# EAGLE design TMR03 (EAGLE 9.2.0)
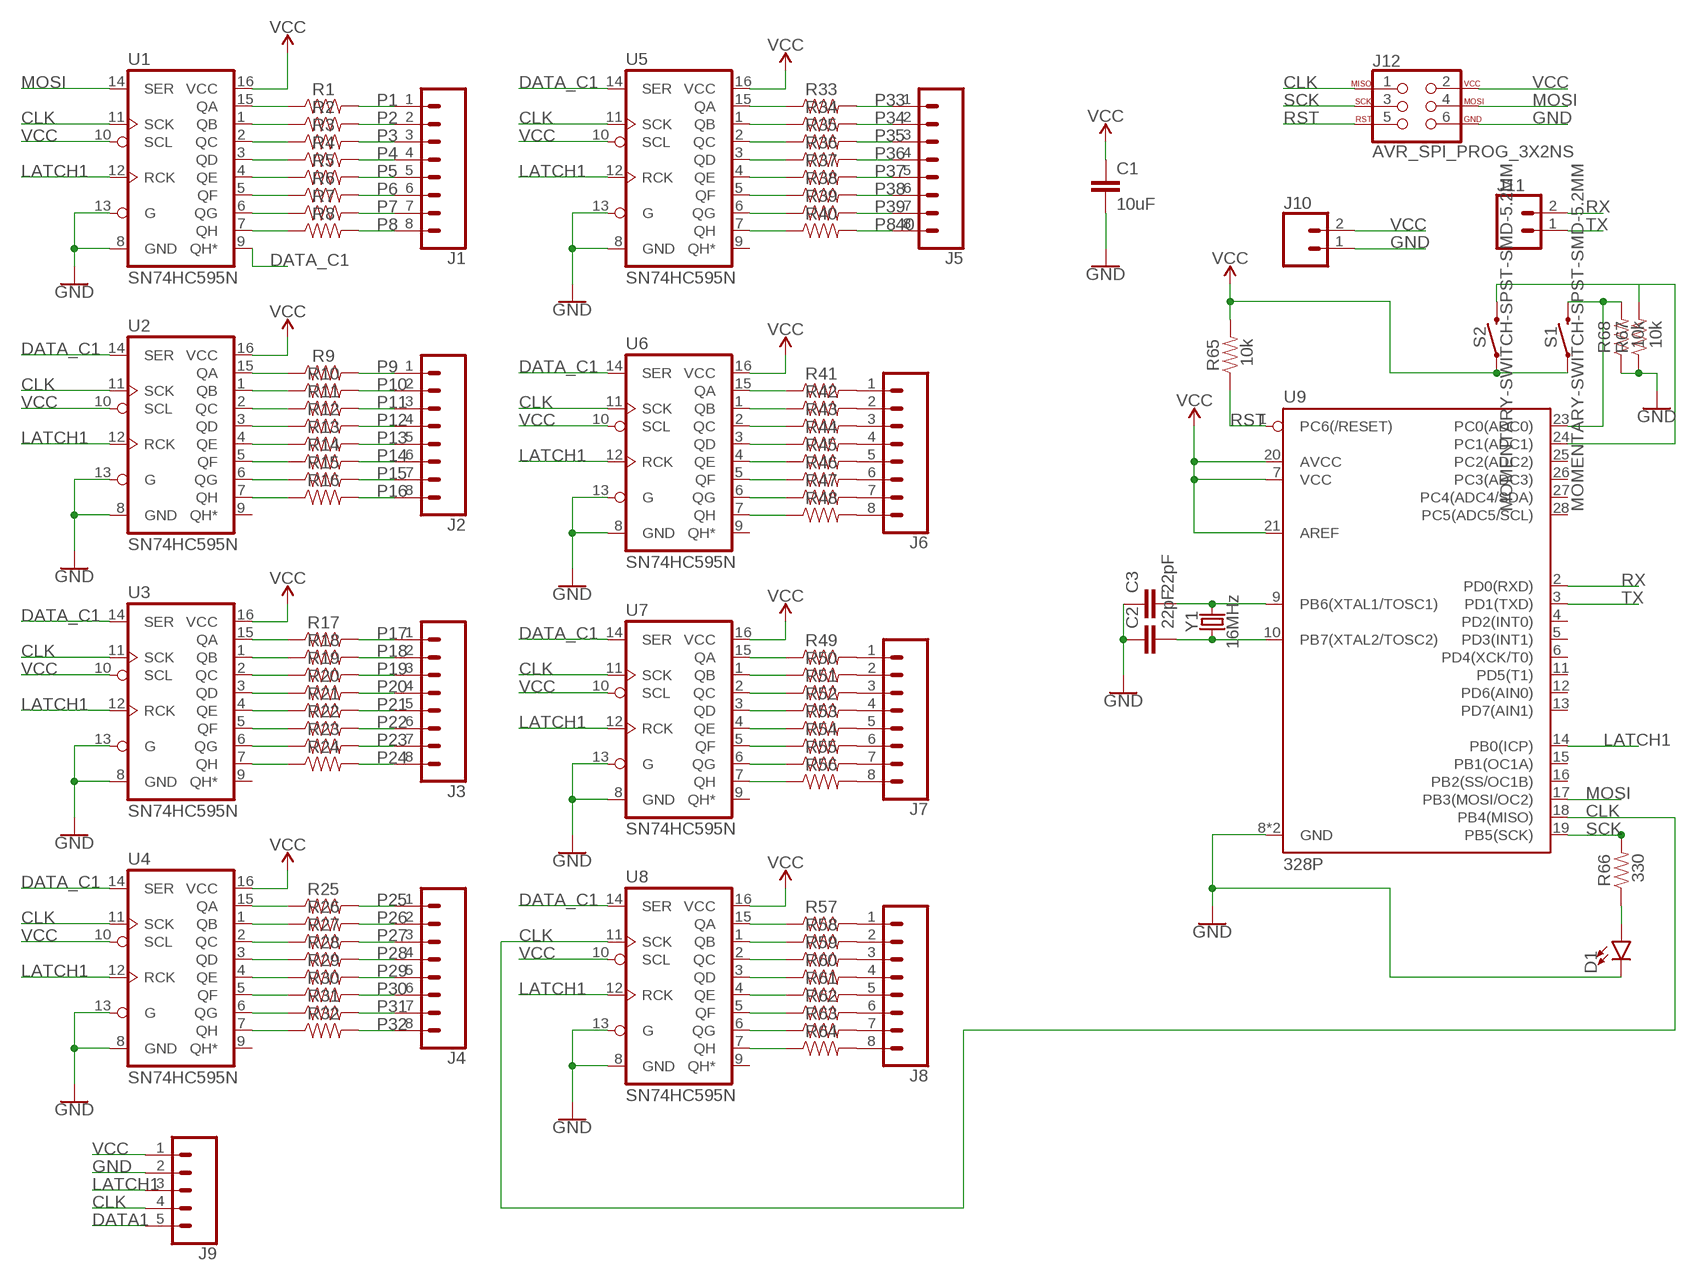
[diagram p0: schematic, sheet 1]

## Parts
C1  10uF  10UF-1206-6.3V-20%  [1206]
C2  22pF  10UF-1206-6.3V-20%  [1206]
C3  22pF  10UF-1206-6.3V-20%  [1206]
D1  LED3MM  [LED_3MM]
J1  CONN_08"  [1X08]
J2  CONN_08"  [1X08]
J3  CONN_08"  [1X08]
J4  CONN_08"  [1X08]
J5  CONN_08"  [1X08]
J6  CONN_08"  [1X08]
J7  CONN_08"  [1X08]
J8  CONN_08"  [1X08]
J9  CONN_05  [1X05]
J10  CONN_02JST-PTH-2  [JST-2-PTH]
J11  CONN_02  [1X02]
J12  AVR_SPI_PROG_3X2NS  [2X3-NS]
R1  RESISTOR1206  [1206]
R2  RESISTOR1206  [1206]
R3  RESISTOR1206  [1206]
R4  RESISTOR1206  [1206]
R5  RESISTOR1206  [1206]
R6  RESISTOR1206  [1206]
R7  RESISTOR1206  [1206]
R8  RESISTOR1206  [1206]
R9  RESISTOR1206  [1206]
R10  RESISTOR1206  [1206]
R11  RESISTOR1206  [1206]
R12  RESISTOR1206  [1206]
R13  RESISTOR1206  [1206]
R14  RESISTOR1206  [1206]
R15  RESISTOR1206  [1206]
R16  RESISTOR1206  [1206]
R17  RESISTOR1206  [1206]
R18  RESISTOR1206  [1206]
R19  RESISTOR1206  [1206]
R20  RESISTOR1206  [1206]
R21  RESISTOR1206  [1206]
R22  RESISTOR1206  [1206]
R23  RESISTOR1206  [1206]
R24  RESISTOR1206  [1206]
R25  RESISTOR1206  [1206]
R26  RESISTOR1206  [1206]
R27  RESISTOR1206  [1206]
R28  RESISTOR1206  [1206]
R29  RESISTOR1206  [1206]
R30  RESISTOR1206  [1206]
R31  RESISTOR1206  [1206]
R32  RESISTOR1206  [1206]
R33  RESISTOR1206  [1206]
R34  RESISTOR1206  [1206]
R35  RESISTOR1206  [1206]
R36  RESISTOR1206  [1206]
R37  RESISTOR1206  [1206]
R38  RESISTOR1206  [1206]
R39  RESISTOR1206  [1206]
R40  RESISTOR1206  [1206]
R41  RESISTOR1206  [1206]
R42  RESISTOR1206  [1206]
R43  RESISTOR1206  [1206]
R44  RESISTOR1206  [1206]
R45  RESISTOR1206  [1206]
R46  RESISTOR1206  [1206]
R47  RESISTOR1206  [1206]
R48  RESISTOR1206  [1206]
R49  RESISTOR1206  [1206]
R50  RESISTOR1206  [1206]
R51  RESISTOR1206  [1206]
R52  RESISTOR1206  [1206]
R53  RESISTOR1206  [1206]
R54  RESISTOR1206  [1206]
R55  RESISTOR1206  [1206]
R56  RESISTOR1206  [1206]
R57  RESISTOR1206  [1206]
R58  RESISTOR1206  [1206]
R59  RESISTOR1206  [1206]
R60  RESISTOR1206  [1206]
R61  RESISTOR1206  [1206]
R62  RESISTOR1206  [1206]
R63  RESISTOR1206  [1206]
R64  RESISTOR1206  [1206]
R65  10k  RESISTOR1206  [1206]
R66  330  RESISTOR1206  [1206]
R67  10k  RESISTOR1206  [1206]
R68  10k  RESISTOR1206  [1206]
S1  MOMENTARY-SWITCH-SPST-SMD-5.2MM  [TACTILE_SWITCH_SMD_5.2MM]
S2  MOMENTARY-SWITCH-SPST-SMD-5.2MM  [TACTILE_SWITCH_SMD_5.2MM]
U1  SN74HC595N  74HC595N  [DIP16]
U2  SN74HC595N  74HC595N  [DIP16]
U3  SN74HC595N  74HC595N  [DIP16]
U4  SN74HC595N  74HC595N  [DIP16]
U5  SN74HC595N  74HC595N  [DIP16]
U6  SN74HC595N  74HC595N  [DIP16]
U7  SN74HC595N  74HC595N  [DIP16]
U8  SN74HC595N  74HC595N  [DIP16]
U9  328P  ATMEGA328P_PDIP  [DIP28]
Y1  16MHz  CRYSTAL-16MHZPTH-HC49US  [HC49US]

## Nets
CLK: J9.4 J12.1 U1.11(SCK) U2.11(SCK) U3.11(SCK) U4.11(SCK) U5.11(SCK) U6.11(SCK) U7.11(SCK) U8.11(SCK) U9.18(PB4(MISO))
DATA1: J9.5
DATA_C1: U1.9(QH*) U2.14(SER) U3.14(SER) U4.14(SER) U5.14(SER) U6.14(SER) U7.14(SER) U8.14(SER)
GND: C1.2 C2.1 C3.1 J9.2 J10.1 J12.6 R67.1 R68.1 U1.8(GND) U1.13(G) U2.8(GND) U2.13(G) U3.8(GND) U3.13(G) U4.8(GND) U4.13(G) U5.8(GND) U5.13(G) U6.8(GND) U6.13(G) U7.8(GND) U7.13(G) U8.8(GND) U8.13(G)
LATCH1: J9.3 U1.12(RCK) U2.12(RCK) U3.12(RCK) U4.12(RCK) U5.12(RCK) U6.12(RCK) U7.12(RCK) U8.12(RCK) U9.14(PB0(ICP))
MOSI: J12.4 U1.14(SER) U9.17(PB3(MOSI/OC2))
N$1: R1.1 U1.15(QA)
N$2: R2.1 U1.1(QB)
N$3: R3.1 U1.2(QC)
N$4: R4.1 U1.3(QD)
N$5: R5.1 U1.4(QE)
N$6: R6.1 U1.5(QF)
N$7: R7.1 U1.6(QG)
N$8: R8.1 U1.7(QH)
N$9: R9.1 U2.15(QA)
N$10: R10.1 U2.1(QB)
N$11: R11.1 U2.2(QC)
N$12: R12.1 U2.3(QD)
N$13: R13.1 U2.4(QE)
N$14: R14.1 U2.5(QF)
N$15: R15.1 U2.6(QG)
N$16: R16.1 U2.7(QH)
N$17: R17.1 U3.15(QA)
N$18: R18.1 U3.1(QB)
N$19: R19.1 U3.2(QC)
N$20: R20.1 U3.3(QD)
N$21: R21.1 U3.4(QE)
N$22: R22.1 U3.5(QF)
N$23: R23.1 U3.6(QG)
N$24: R24.1 U3.7(QH)
N$25: R25.1 U4.15(QA)
N$26: R26.1 U4.1(QB)
N$27: R27.1 U4.2(QC)
N$28: R28.1 U4.3(QD)
N$29: R29.1 U4.4(QE)
N$30: R30.1 U4.5(QF)
N$31: R31.1 U4.6(QG)
N$32: R32.1 U4.7(QH)
N$33: R33.1 U5.15(QA)
N$34: R34.1 U5.1(QB)
N$35: R35.1 U5.2(QC)
N$36: R36.1 U5.3(QD)
N$37: R37.1 U5.4(QE)
N$38: R38.1 U5.5(QF)
N$39: R39.1 U5.6(QG)
N$40: R40.1 U5.7(QH)
N$41: R41.1 U6.15(QA)
N$42: R42.1 U6.1(QB)
N$43: R43.1 U6.2(QC)
N$44: R44.1 U6.3(QD)
N$45: R45.1 U6.4(QE)
N$46: R46.1 U6.5(QF)
N$47: R47.1 U6.6(QG)
N$48: R48.1 U6.7(QH)
N$49: R49.1 U7.15(QA)
N$50: R50.1 U7.1(QB)
N$51: R51.1 U7.2(QC)
N$52: R52.1 U7.3(QD)
N$53: R53.1 U7.4(QE)
N$54: R54.1 U7.5(QF)
N$55: R55.1 U7.6(QG)
N$56: R56.1 U7.7(QH)
N$57: R57.1 U8.15(QA)
N$58: R58.1 U8.1(QB)
N$59: R59.1 U8.2(QC)
N$60: R60.1 U8.3(QD)
N$61: R61.1 U8.4(QE)
N$62: R62.1 U8.5(QF)
N$63: R63.1 U8.6(QG)
N$64: R64.1 U8.7(QH)
N$65: J6.1 R41.2
N$66: J6.2 R42.2
N$67: J6.3 R43.2
N$68: J6.4 R44.2
N$69: J6.5 R45.2
N$70: J6.6 R46.2
N$71: J6.7 R47.2
N$72: J6.8 R48.2
N$73: J7.1 R49.2
N$74: J7.2 R50.2
N$75: J7.3 R51.2
N$76: J7.4 R52.2
N$77: J7.5 R53.2
N$78: J7.6 R54.2
N$79: J7.7 R55.2
N$80: J7.8 R56.2
N$81: J8.1 R57.2
N$82: J8.2 R58.2
N$83: J8.3 R59.2
N$84: J8.4 R60.2
N$85: J8.5 R61.2
N$86: J8.6 R62.2
N$87: J8.7 R63.2
N$88: J8.8 R64.2
N$89: C3.2 U9.9(PB6(XTAL1/TOSC1)) Y1.2
N$90: R68.2 S1.3 U9.23(PC0(ADC0))
N$91: C2.2 U9.10(PB7(XTAL2/TOSC2)) Y1.1
N$92: R65.2 S1.1 S2.1 ; supply symbol labelled VCC
N$93: U9.7(VCC) U9.20(AVCC) U9.21(AREF) ; supply symbol labelled VCC
N$94: D1.K(C) U9.8(GND) U9.22(GND) ; supply symbol labelled GND
N$95: R67.2 S2.3 U9.24(PC1(ADC1))
N$96: D1.A R66.1
P1: J1.1 R1.2
P2: J1.2 R2.2
P3: J1.3 R3.2
P4: J1.4 R4.2
P5: J1.5 R5.2
P6: J1.6 R6.2
P7: J1.7 R7.2
P8: J1.8 R8.2
P9: J2.1 R9.2
P10: J2.2 R10.2
P11: J2.3 R11.2
P12: J2.4 R12.2
P13: J2.5 R13.2
P14: J2.6 R14.2
P15: J2.7 R15.2
P16: J2.8 R16.2
P17: J3.1 R17.2
P18: J3.2 R18.2
P19: J3.3 R19.2
P20: J3.4 R20.2
P21: J3.5 R21.2
P22: J3.6 R22.2
P23: J3.7 R23.2
P24: J3.8 R24.2
P25: J4.1 R25.2
P26: J4.2 R26.2
P27: J4.3 R27.2
P28: J4.4 R28.2
P29: J4.5 R29.2
P30: J4.6 R30.2
P31: J4.7 R31.2
P32: J4.8 R32.2
P33: J5.1 R33.2
P34: J5.2 R34.2
P35: J5.3 R35.2
P36: J5.4 R36.2
P37: J5.5 R37.2
P38: J5.6 R38.2
P39: J5.7 R39.2
P840: J5.8 R40.2
RST: J12.5 R65.1 U9.1(PC6(/RESET))
RX: J11.2 U9.2(PD0(RXD))
SCK: J12.3 R66.2 U9.19(PB5(SCK))
TX: J11.1 U9.3(PD1(TXD))
VCC: C1.1 J9.1 J10.2 J12.2 U1.10(SCL) U1.16(VCC) U2.10(SCL) U2.16(VCC) U3.10(SCL) U3.16(VCC) U4.10(SCL) U4.16(VCC) U5.10(SCL) U5.16(VCC) U6.10(SCL) U6.16(VCC) U7.10(SCL) U7.16(VCC) U8.10(SCL) U8.16(VCC)
Unconnected: U2.9(QH*) U3.9(QH*) U4.9(QH*) U5.9(QH*) U6.9(QH*) U7.9(QH*) U8.9(QH*) U9.4(PD2(INT0)) U9.5(PD3(INT1)) U9.6(PD4(XCK/T0)) U9.11(PD5(T1)) U9.12(PD6(AIN0)) U9.13(PD7(AIN1)) U9.15(PB1(OC1A)) U9.16(PB2(SS/OC1B)) U9.25(PC2(ADC2)) U9.26(PC3(ADC3)) U9.27(PC4(ADC4/SDA)) U9.28(PC5(ADC5/SCL))

## Library data of the parts
C1 = SparkFun-Capacitors:10UF: 10.0µF ceramic capacitors A capacitor is a passive two-terminal electrical component used to store electrical energy temporarily in an electric field.; PROD_ID: CAP-10057
C2 C3 = SparkFun-Capacitors:10UF: 10.0µF ceramic capacitors A capacitor is a passive two-terminal electrical component used to store electrical energy temporarily in an electric field.; PROD_ID: CAP-10057; VALUE: 10uF
D1 = SparkFun-LED:LED: LED (Generic) Standard schematic elements and footprints for 5mm, 3mm, 1206, and 0603 sized LEDs. Generic LEDs with no color specified.; PROD_ID: DIO-08794
J1-J8 = SparkFun-Connectors:CONN_08: Multi connection point. Often used as Generic Header-pin footprint for 0.1 inch spaced/style header connections On any of the 0.1 inch spaced packages, you can populate with these: Break Away Headers - Straight <https://www.sparkfun.com/products/116> (PRT-00116) Break Away Male Headers - Right Angle <https://www.sparkfun.com/products/553> (PRT-00553) Female Headers <https://www.sparkfun.com/products/115> (PRT-00115) Break Away Headers - Machine Pin <https://www.sparkfun.com/products/117> (PRT-00117) Break Away Female Headers - Swiss Machine Pin <https://www.sparkfun.com/products/743> (PRT-00743) Arduino Stackable Header - 8 Pin <https://www.sparkfun.com/products/9279> (PRT-09279) For SCREWTERMINALS and SPRING TERMINALS visit here: Screw Terimnals on SparkFun.com <https://www.sparkfun.com/search/results?term=Screw+Terminals> (5mm/3.5mm/2.54mm spacing) This device is also useful as a general connection point to wire up your design to another part of your project. Our various solder wires solder well into these plated through hole pads. Hook-Up Wire - Assortment (Stranded, 22 AWG) <https://www.sparkfun.com/products/11375> (PRT-11375) Hook-Up Wire - Assortment (Solid Core, 22 AWG) <https://www.sparkfun.com/products/11367> (PRT-11367) View the entire wire category on our website here <https://www.sparkfun.com/categories/141> Special notes: Molex polarized connector foot print use with SKU : PRT-08231 with associated crimp pins and housings. 1MM SMD Version SKU: PRT-10208 NOTES ON THE VARIANTS LOCK and LOCK_LONGPADS... This footprint was designed to help hold the alignment of a through-hole component (i.e. 6-pin header) while soldering it into place. You may notice that each hole has been shifted either up or down by 0.005 of an inch from it's more standard position (which is a perfectly straight line). This slight alteration caused the pins (the squares in the middle) to touch the edges of the holes. Because they are alternating, it causes a "brace" to hold the component in place. 0.005 has proven to be the perfect amount of "off-center" position when using our standard breakaway headers. Although looks a little odd when you look at the bare footprint, once you have a header in there, the alteration is very hard to notice. Also,if you push a header all the way into place, it is covered up entirely on the bottom side.; PROD_ID: CONN-08438
J9 = SparkFun-Connectors:CONN_05: Multi connection point. Often used as Generic Header-pin footprint for 0.1 inch spaced/style header connections On any of the 0.1 inch spaced packages, you can populate with these: Break Away Headers - Straight <https://www.sparkfun.com/products/116> (PRT-00116) Break Away Male Headers - Right Angle <https://www.sparkfun.com/products/553> (PRT-00553) Female Headers <https://www.sparkfun.com/products/115> (PRT-00115) Break Away Headers - Machine Pin <https://www.sparkfun.com/products/117> (PRT-00117) Break Away Female Headers - Swiss Machine Pin <https://www.sparkfun.com/products/743> (PRT-00743) For SCREWTERMINALS and SPRING TERMINALS visit here: Screw Terimnals on SparkFun.com <https://www.sparkfun.com/search/results?term=Screw+Terminals> (5mm/3.5mm/2.54mm spacing) This device is also useful as a general connection point to wire up your design to another part of your project. Our various solder wires solder well into these plated through hole pads. Hook-Up Wire - Assortment (Stranded, 22 AWG) <https://www.sparkfun.com/products/11375> (PRT-11375) Hook-Up Wire - Assortment (Solid Core, 22 AWG) <https://www.sparkfun.com/products/11367> (PRT-11367) View the entire wire category on our website here <https://www.sparkfun.com/categories/141> Special notes: Molex polarized connector foot print use with SKU : PRT-08231 with associated crimp pins and housings. 1MM SMD Version SKU: PRT-10208
J10 = SparkFun-Connectors:CONN_02: Multi connection point. Often used as Generic Header-pin footprint for 0.1 inch spaced/style header connections On any of the 0.1 inch spaced packages, you can populate with these: Break Away Headers - Straight <https://www.sparkfun.com/products/116> (PRT-00116) Break Away Male Headers - Right Angle <https://www.sparkfun.com/products/553> (PRT-00553) Female Headers <https://www.sparkfun.com/products/115> (PRT-00115) Break Away Headers - Machine Pin <https://www.sparkfun.com/products/117> (PRT-00117) Break Away Female Headers - Swiss Machine Pin <https://www.sparkfun.com/products/743> (PRT-00743) For SCREWTERMINALS and SPRING TERMINALS visit here: Screw Terimnals on SparkFun.com <https://www.sparkfun.com/search/results?term=Screw+Terminals> (5mm/3.5mm/2.54mm spacing) This device is also useful as a general connection point to wire up your design to another part of your project. Our various solder wires solder well into these plated through hole pads. Hook-Up Wire - Assortment (Stranded, 22 AWG) <https://www.sparkfun.com/products/11375> (PRT-11375) Hook-Up Wire - Assortment (Solid Core, 22 AWG) <https://www.sparkfun.com/products/11367> (PRT-11367) View the entire wire category on our website here <https://www.sparkfun.com/categories/141> Special notes: Molex polarized connector foot print use with: PRT-08233 with associated crimp pins and housings. 2.54_SCREWTERM for use with PRT-10571. 3.5mm Screw Terminal footprints for PRT-08084 5mm Screw Terminal footprints for use with PRT-08432; PROD_ID: CONN-09863; SKU: PRT-09914
J11 = SparkFun-Connectors:CONN_02: Multi connection point. Often used as Generic Header-pin footprint for 0.1 inch spaced/style header connections On any of the 0.1 inch spaced packages, you can populate with these: Break Away Headers - Straight <https://www.sparkfun.com/products/116> (PRT-00116) Break Away Male Headers - Right Angle <https://www.sparkfun.com/products/553> (PRT-00553) Female Headers <https://www.sparkfun.com/products/115> (PRT-00115) Break Away Headers - Machine Pin <https://www.sparkfun.com/products/117> (PRT-00117) Break Away Female Headers - Swiss Machine Pin <https://www.sparkfun.com/products/743> (PRT-00743) For SCREWTERMINALS and SPRING TERMINALS visit here: Screw Terimnals on SparkFun.com <https://www.sparkfun.com/search/results?term=Screw+Terminals> (5mm/3.5mm/2.54mm spacing) This device is also useful as a general connection point to wire up your design to another part of your project. Our various solder wires solder well into these plated through hole pads. Hook-Up Wire - Assortment (Stranded, 22 AWG) <https://www.sparkfun.com/products/11375> (PRT-11375) Hook-Up Wire - Assortment (Solid Core, 22 AWG) <https://www.sparkfun.com/products/11367> (PRT-11367) View the entire wire category on our website here <https://www.sparkfun.com/categories/141> Special notes: Molex polarized connector foot print use with: PRT-08233 with associated crimp pins and housings. 2.54_SCREWTERM for use with PRT-10571. 3.5mm Screw Terminal footprints for PRT-08084 5mm Screw Terminal footprints for use with PRT-08432
J12 = SparkFun-Connectors:AVR_SPI_PROG_3X2: AVR ISP 6 Pin This is the reduced ISP connector for AVR programming. Common on Arduino. This footprint will take up less PCB space and can be used with a 10-pin to 6-pin adapter such as SKU: BOB-08508 **Special note about "TEST_POINT" package. The stop mask is on the top side, so if you want your programming test points to be on the bottom of your board, make sure to place this package on the bottom side of the board. This also ensure that the orientation to program from the bottom side will be correct. SparkFun Products: SparkFun ISP Pogo Adapter <https://www.sparkfun.com/products/11591> - NS Tiny AVR Programmer <https://www.sparkfun.com/products/11801> -PTH
R1-R68 = SparkFun-Resistors:RESISTOR: Generic Resistor Package
S1 S2 = SparkFun-Switches:MOMENTARY-SWITCH-SPST: Momentary Switch (Pushbutton) - SPST Normally-open (NO) SPST momentary switches (buttons, pushbuttons). Variants PTH-12MM - 12mm square, through-hole Momentary Pushbutton Switch - 12mm Square <https://www.sparkfun.com/products/9190> (COM-09190) PTH-6.0MM, PTH-6.0MM-KIT - 6.0mm square, through-hole Mini Pushbutton Switch <https://www.sparkfun.com/products/97> (COM-00097) KIT package intended for soldering kit's - only one side of pads' copper is exposed. PTH-RIGHT-ANGLE-KIT - Right-angle, through-hole Right Angle Tactile Button <https://www.sparkfun.com/products/10791> - Used on SparkFun BigTime Watch Kit <https://www.sparkfun.com/products/11734> SMD-12MM - 12mm square, surface-mount Tactile Button - SMD (12mm) <https://www.sparkfun.com/products/12993> (COM-12993) Used on SparkFun PicoBoard <https://www.sparkfun.com/products/11888> SMD-4.5MM - 4.5mm Square Trackball Switch Used on SparkFun Blackberry Trackballer Breakout <https://www.sparkfun.com/products/13169> SMD-4.6MMX2.8MM - 4.60mm x 2.80mm, surface mount Used on SparkFun SAMD21 Mini Breakout <https://www.sparkfun.com/products/13664> SMD-5.2MM, SMD-5.2-REDUNDANT - 5.2mm square, surface-mount Mini Pushbutton Switch - SMD <https://www.sparkfun.com/products/8720> (COM-08720) Used on Arduino Pro Mini <https://www.sparkfun.com/products/11114> REDUNDANT package connects both switch circuits together SMD-6.0X3.5MM - 6.0 x 3.5mm, surface mount Momentary Reset Switch SMD <https://www.sparkfun.com/products/8229> (COM-08229) SMD-6.2MM-TALL - 6.2mm square, surface mount Tactile Button - SMD (6mm) <https://www.sparkfun.com/products/12992> Used on SparkFun Digital Sandbox <https://www.sparkfun.com/products/12651> SMD-RIGHT-ANGLE - Right-angle, surface mount Used on SparkFun Block for Intel® Edison - Arduino <https://www.sparkfun.com/products/13036>; PROD_ID: SWCH-08247; SF_SKU: COM-08720
U1-U8 = SparkFun-IC-Logic:74*595: 8-Bit Shift Register (Serial to Parallel) Datasheet <http://cdn.sparkfun.com/datasheets/BreakoutBoards/MM74HC595.pdf> SparkFun Products SparkFun Shift Register Breakout - 74HC595 <https://www.sparkfun.com/products/10680> (BOB-10680); PROD_ID: IC-13123
U9 = SparkFun-IC-Microcontroller:ATMEGA328P_PDIP: Atmel 328P Through hole ATMEGA328P uC used in the Arduino 32kb flash, 1k EEPROM, 2k SRAM Datasheet <http://www.sparkfun.com/datasheets/Components/SMD/ATMega328.pdf> SparkFun Products Storefront component: AVR 28 Pin 20MHz 32K 6A/D - ATMega328P <https://www.sparkfun.com/products/9061> (COM-09061) SparkFun Simon Says - Through-Hole Soldering Kit <https://www.sparkfun.com/products/10547> (KIT-10547) SparkFun Learn to Solder - Simon Says <https://www.sparkfun.com/products/13708> (KIT-13708) SparkFun BigTime Watch Kit <https://www.sparkfun.com/products/11734> (KIT-11734) SparkFun ClockIt <https://www.sparkfun.com/products/10930> (KIT-10930) SparkFun Serial Enabled LCD Kit <https://www.sparkfun.com/products/10097> (LCD-10097) SparkFun Simon Tilts - Through Hole Soldering Kit <https://www.sparkfun.com/products/12634> (KIT-12634) SparkFun Frequency Counter Kit <https://www.sparkfun.com/products/10140> (KIT-10140) FabFM Radio Kit <https://www.sparkfun.com/products/11043> (KIT-11043) SparkFun Binary Blaster Kit <https://www.sparkfun.com/products/12037> (KIT-12037) SparkFun Metro-Gnome <https://www.sparkfun.com/products/9236> (KIT-09236) ATmega328 with Arduino Optiboot (Uno) <https://www.sparkfun.com/products/10524> (DEV-10524); PROD_ID: IC-09136
Y1 = SparkFun-Clocks:CRYSTAL-16MHZ: 16MHz Crystal Digikey Example <http://www.digikey.com/product-search/en?keywords=535-9122-1-ND> Frequency: 16MHz Frequency Stability: ±50ppm Frequency Tolerance: ±20ppm Load Capacitance: 18pF SparkFun Products: Pro Micro -5V/16MHz <https://www.sparkfun.com/products/12640> SparkFun Serial Enabled LCD Kit <https://www.sparkfun.com/products/10097>; PROD_ID: XTAL-08181; SF_ID: COM-00536

## Board
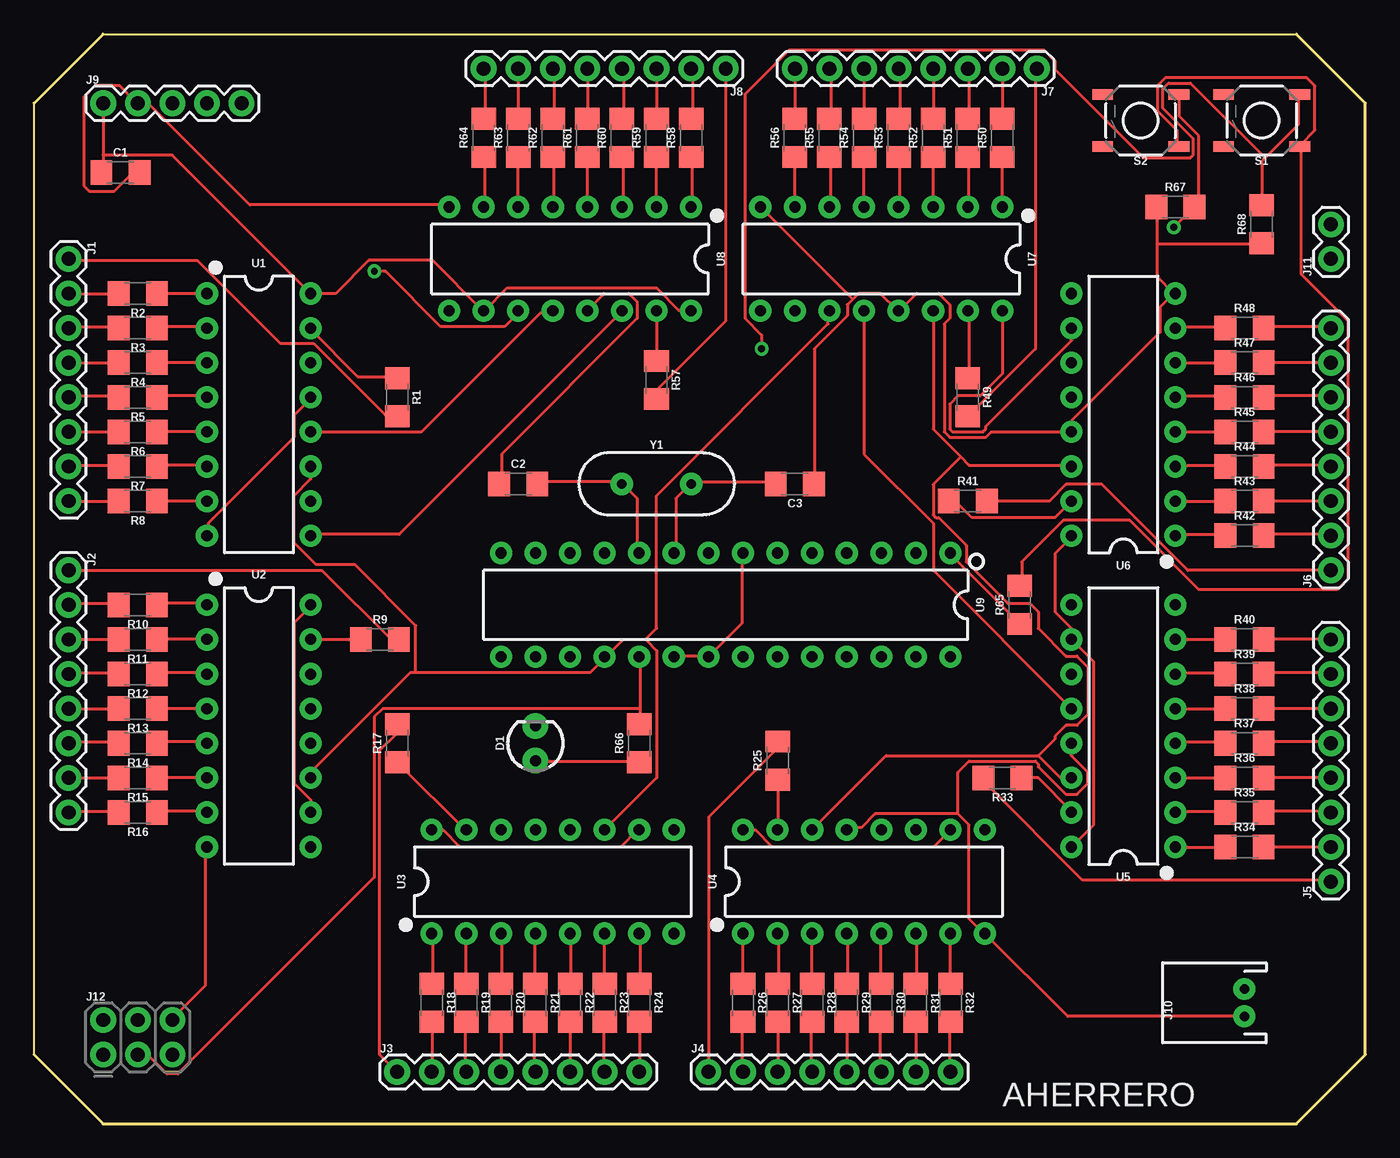
[diagram p1: board, top side]
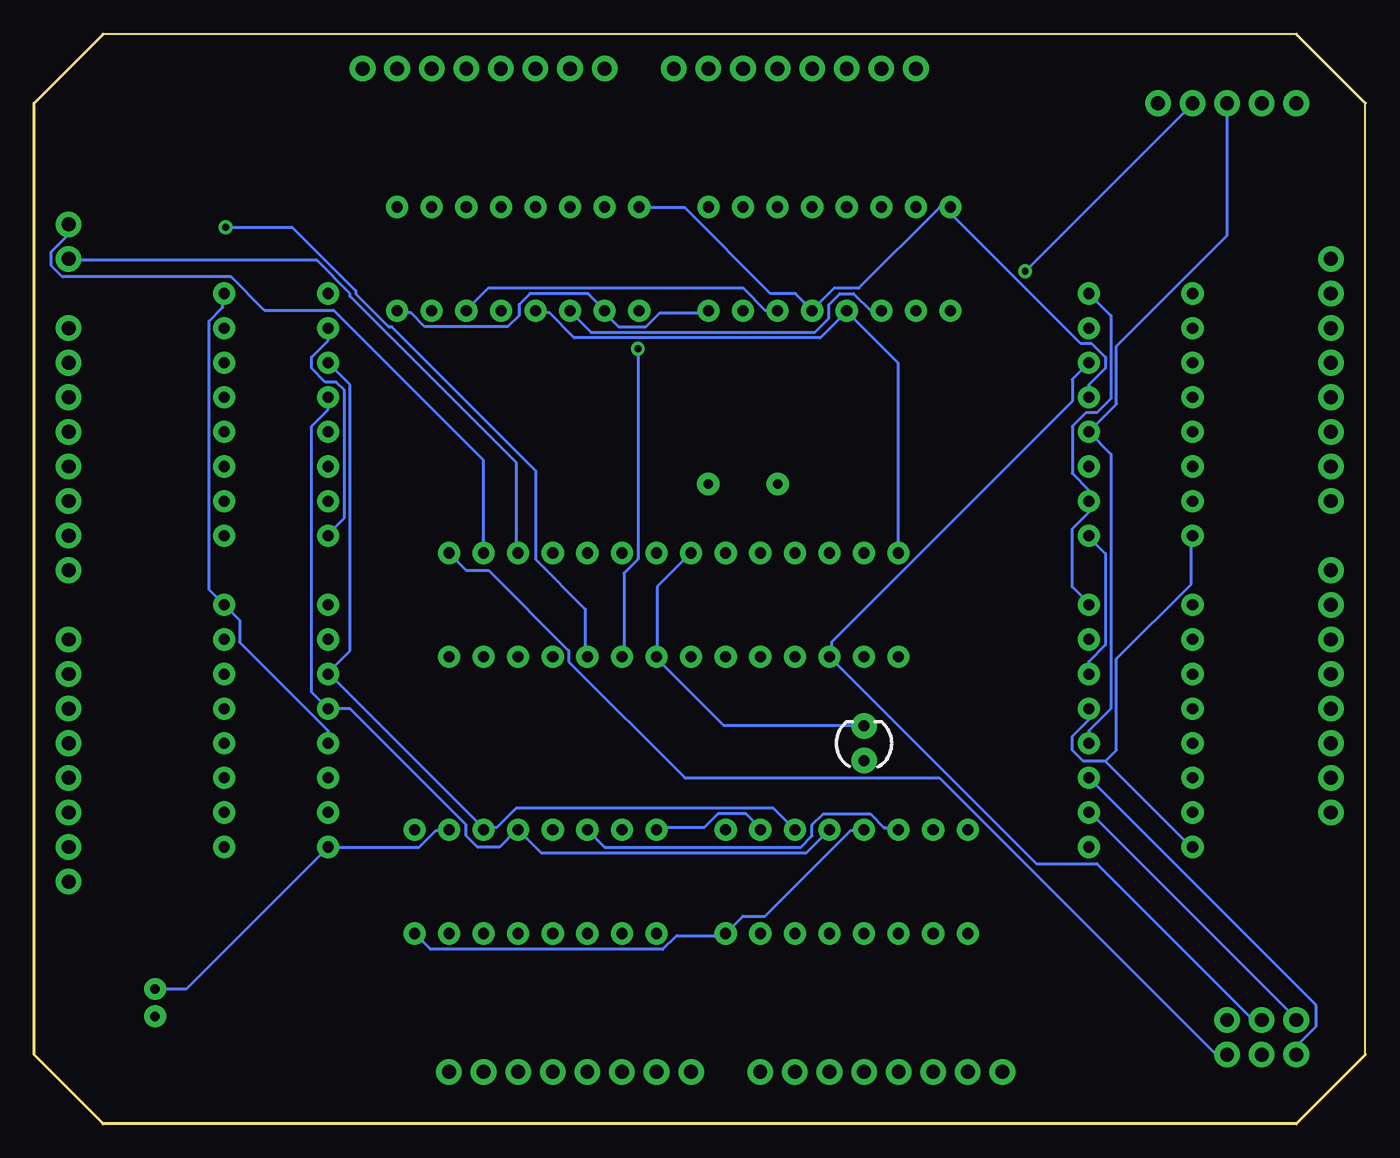
[diagram p2: board, bottom side, seen from below]

Size 97.79 x 80.01 mm. Coordinates in mm from the lower left corner, seen from the top.
Outline: 0,5.08 0,74.93 5.08,80.01 92.71,80.01 97.79,74.93 97.79,5.08 92.71,0 5.08,0 0,5.08
Copper layers (1*16): Top 0.035mm / dielectric 1.5mm / Bottom 0.035mm
Design rules "SparkFun": minimum track width 8mil, minimum drill 20mil, track to track 8mil, track to pad 8mil, pad to pad 8mil, via to via 8mil, smd to smd 8mil, copper to edge 8mil, drill to drill 8mil, minimum pad ring 12mil, minimum via ring 10mil, stop-mask expansion 4mil, vias tented up to drill 20mil, thermal gap 10mil

### Footprints (pad centres in the part's own frame; a part is rotated, then mirrored left to right if it is on the bottom)
1206 = smd 1.6 x 1.8: 1 -1.4,0; 2 1.4,0
LED_3MM = drill 0.813 pad 1.88: A -1.27,0; K 1.27,0
1X08 = drill 1.016 pad 1.88: 1 0,0; 2 2.54,0; 3 5.08,0; 4 7.62,0; 5 10.16,0; 6 12.7,0; 7 15.24,0; 8 17.78,0
1X05 = drill 1.016 pad 1.88: 1 0,0; 2 2.54,0; 3 5.08,0; 4 7.62,0; 5 10.16,0
JST-2-PTH = drill 0.7 pad 1.6: 1 -1,0; 2 1,0
1X02 = drill 1.016 pad 1.88: 1 0,0; 2 2.54,0
2X3-NS = drill 1.016 pad 1.88: 1 -2.54,-1.27; 2 -2.54,1.27; 3 0,-1.27; 4 0,1.27; 5 2.54,-1.27; 6 2.54,1.27
TACTILE_SWITCH_SMD_5.2MM = smd 1.524 x 0.762: 1 -2.794,1.905; 2 2.794,1.905; 3 -2.794,-1.905; 4 2.794,-1.905
DIP16 = drill 0.813 pad 1.626: 1 -8.89,-3.81; 2 -6.35,-3.81; 3 -3.81,-3.81; 4 -1.27,-3.81; 5 1.27,-3.81; 6 3.81,-3.81; 7 6.35,-3.81; 8 8.89,-3.81; 9 8.89,3.81; 10 6.35,3.81; 11 3.81,3.81; 12 1.27,3.81; 13 -1.27,3.81; 14 -3.81,3.81; 15 -6.35,3.81; 16 -8.89,3.81
DIP28 = drill 0.813 pad 1.626: 1 -16.51,-3.81; 2 -13.97,-3.81; 3 -11.43,-3.81; 4 -8.89,-3.81; 5 -6.35,-3.81; 6 -3.81,-3.81; 7 -1.27,-3.81; 8 1.27,-3.81; 9 3.81,-3.81; 10 6.35,-3.81; 11 8.89,-3.81; 12 11.43,-3.81; 13 13.97,-3.81; 14 16.51,-3.81; 15 16.51,3.81; 16 13.97,3.81; 17 11.43,3.81; 18 8.89,3.81; 19 6.35,3.81; 20 3.81,3.81; 21 1.27,3.81; 22 -1.27,3.81; 23 -3.81,3.81; 24 -6.35,3.81; 25 -8.89,3.81; 26 -11.43,3.81; 27 -13.97,3.81; 28 -16.51,3.81
HC49US = drill 0.7 pad 1.651: 1 -2.54,0; 2 2.54,0

### Placement (x,y rotation side)
C1  6.35,69.85 0 top
C2  35.56,46.99 0 top
C3  55.88,46.99 180 top
D1  36.83,27.94 90 top
J1  2.54,63.5 270 top
J2  2.54,40.64 270 top
J3  26.67,3.81 0 top
J4  49.53,3.81 0 top
J5  95.25,17.78 90 top
J6  95.25,40.64 90 top
J7  73.66,77.47 180 top
J8  50.8,77.47 180 top
J9  5.08,74.93 0 top
J10  88.9,8.89 90 top
J11  95.25,63.5 90 top
J12  7.62,6.35 0 top
R1  26.67,53.34 270 top
R2  7.62,60.96 180 top
R3  7.62,58.42 180 top
R4  7.62,55.88 180 top
R5  7.62,53.34 180 top
R6  7.62,50.8 180 top
R7  7.62,48.26 180 top
R8  7.62,45.72 180 top
R9  25.4,35.56 0 top
R10  7.62,38.1 180 top
R11  7.62,35.56 180 top
R12  7.62,33.02 180 top
R13  7.62,30.48 180 top
R14  7.62,27.94 180 top
R15  7.62,25.4 180 top
R16  7.62,22.86 180 top
R17  26.67,27.94 90 top
R18  29.21,8.89 270 top
R19  31.75,8.89 270 top
R20  34.29,8.89 270 top
R21  36.83,8.89 270 top
R22  39.37,8.89 270 top
R23  41.91,8.89 270 top
R24  44.45,8.89 270 top
R25  54.61,26.67 90 top
R26  52.07,8.89 270 top
R27  54.61,8.89 270 top
R28  57.15,8.89 270 top
R29  59.69,8.89 270 top
R30  62.23,8.89 270 top
R31  64.77,8.89 270 top
R32  67.31,8.89 270 top
R33  71.12,25.4 180 top
R34  88.9,20.32 0 top
R35  88.9,22.86 0 top
R36  88.9,25.4 0 top
R37  88.9,27.94 0 top
R38  88.9,30.48 0 top
R39  88.9,33.02 0 top
R40  88.9,35.56 0 top
R41  68.58,45.72 0 top
R42  88.9,43.18 0 top
R43  88.9,45.72 0 top
R44  88.9,48.26 0 top
R45  88.9,50.8 0 top
R46  88.9,53.34 0 top
R47  88.9,55.88 0 top
R48  88.9,58.42 0 top
R49  68.58,53.34 270 top
R50  71.12,72.39 90 top
R51  68.58,72.39 90 top
R52  66.04,72.39 90 top
R53  63.5,72.39 90 top
R54  60.96,72.39 90 top
R55  58.42,72.39 90 top
R56  55.88,72.39 90 top
R57  45.72,54.61 270 top
R58  48.26,72.39 90 top
R59  45.72,72.39 90 top
R60  43.18,72.39 90 top
R61  40.64,72.39 90 top
R62  38.1,72.39 90 top
R63  35.56,72.39 90 top
R64  33.02,72.39 90 top
R65  72.39,38.1 90 top
R66  44.45,27.94 90 top
R67  83.82,67.31 0 top
R68  90.17,66.04 90 top
S1  90.17,73.66 180 top
S2  81.28,73.66 180 top
U1  16.51,52.07 270 top
U2  16.51,29.21 270 top
U3  38.1,17.78 0 top
U4  60.96,17.78 0 top
U5  80.01,29.21 90 top
U6  80.01,52.07 90 top
U7  62.23,63.5 180 top
U8  39.37,63.5 180 top
U9  50.8,38.1 180 top
Y1  45.72,46.99 0 top

### Tracks (layer width: path | path; a pad name or v marks a point on that pad's centre or on a via)
CLK  (via drill 0.51)
  Top 0.203: v24.99,62.59 25.81,62.59 29.87,58.52 34.54,58.52 35.56,59.54 U8.11 | U2.11 20.32,25.81 27.64,33.12 28.04,33.12 | 28.04,33.12 40.84,33.12 41.86,34.14 U9.18 42.06,34.34 43.28,35.56 44.91,35.56 | U1.11 20.32,47.35 19.1,46.13 19.1,42.67 20.73,41.05 23.57,41.05 28.04,36.58 28.04,33.12 | U3.11 45.72,25.4 45.72,34.75 44.91,35.56 | 44.91,35.56 45.72,36.37 45.72,46.13 58.32,58.73 58.32,59.54 U7.11
  Bottom 0.203: U8.11 35.56,59.74 36.37,59.74 37.59,60.96 38.61,60.96 39.42,60.15 39.42,59.13 40.44,58.12 56.9,58.12 58.32,59.54 U7.11 | v24.99,62.59 12.8,74.78 J9.4 | 76.2,33.12 64.82,21.74 U4.11 64.62,21.74 63.8,21.74 62.38,23.16 43.48,23.16 U3.11 | U6.11 74.57,54.25 74.57,34.75 76.2,33.12 | 76.2,33.12 U5.11 | J12.1 5.08,5.69 3.66,7.11 3.66,8.74 U2.11
DATA_C1
  Top 0.203: U5.14 75.39,25.4 73.76,27.03 | 73.76,27.03 62.59,27.03 U4.14 | 68.07,48.97 66.04,51 U7.14 | 68.07,48.97 68.68,48.36 76.2,48.36 U6.14 | U1.9 20.32,43.28 26.82,43.28 43.08,59.54 U8.14 | 73.76,27.03 74.98,28.25 74.98,28.45 75.79,29.26 76.61,29.26 77.42,30.07 77.42,33.53 76.61,34.34 75.79,34.34 73.76,36.37 73.76,37.59 73.15,38.2 71.53,38.2 68.48,41.25 68.48,42.47 66.45,44.5 66.24,44.5 66.04,44.7 66.04,46.94 68.07,48.97
  Bottom 0.203: U4.14 55.88,20.32 41.45,20.32 40.64,21.13 40.64,21.95 39.83,22.76 36.37,22.76 35.36,21.74 34.34,21.74 U3.14 | U2.14 20.32,33.93 19.1,35.15 19.1,41.86 20.32,43.08 U1.9 | U8.14 43.28,59.74 44.09,59.74 45.72,61.37 64.41,61.37 66.04,59.74 U7.14
GND
  Top 0.203: 83.72,60.96 82.7,59.94 82.7,58.12 76.2,51.61 U6.13 70.31,50.8 69.9,50.39 67.26,50.39 66.85,50.8 66.85,58.73 67.26,59.13 67.26,60.15 66.45,60.96 64.82,60.96 63.6,59.74 U7.13 63.4,59.74 62.18,60.96 60.55,60.96 60.15,60.55 | 67.87,22.76 61.77,22.76 60.76,21.74 59.74,21.74 U4.13 | 67.87,22.76 68.68,21.95 68.68,15.04 69.7,14.02 69.8,14.02 U4.8 75.93,7.89 J10.1 | U5.13 76.2,27.03 77.42,25.81 77.42,24.99 76.61,24.18 75.79,24.18 73.76,26.21 73.76,26.42 73.56,26.62 68.68,26.62 67.87,25.81 67.87,22.76 | U1.8 12.8,43.28 12.8,44.09 19.1,50.39 19.1,52.02 20.32,53.24 U1.13 | U2.8 12.6,20.32 12.6,10.16 10.16,7.72 J12.6 | 60.15,60.55 59.74,60.15 59.74,59.33 57.3,56.9 57.3,47.14 C3.1 | 60.15,60.55 53.44,67.26 U7.8 | C1.2 7.72,69.7 7.11,69.7 5.89,68.48 4.06,68.48 3.66,68.89 3.66,75.39 4.47,76.2 6.3,76.2 7.52,74.98 J9.2 7.72,74.78 8.53,74.78 15.85,67.46 30.48,67.46 U8.8 | C2.1 34.34,47.14 34.34,49.17 44.3,59.13 44.3,60.35 43.69,60.96 41.86,60.96 40.64,59.74 U8.13 | 82.5,64.62 82.5,62.18 83.72,60.96 | 82.5,64.62 82.5,67.26 R67.1 | 83.72,60.96 U6.8 | 82.5,64.62 90.02,64.62 R68.1
  Bottom 0.203: U5.13 76.2,28.85 82.7,35.36 82.7,36.98 U5.8 84.94,39.22 84.94,58.93 83.92,59.94 83.92,60.96 U6.8 | U3.13 36.98,21.54 37.8,21.54 44.09,15.24 45.72,15.24 U3.8 47.14,13.82 50.6,13.82 51.61,12.8 68.68,12.8 U4.8 | U2.13 20.32,29.67 21.54,28.45 21.54,27.43 20.73,26.62 19.1,26.62 | 19.1,26.62 12.8,20.32 U2.8 | 19.1,26.62 18.29,27.43 18.29,34.14 12.8,39.62 12.8,43.08 U1.8 | 30.89,67.26 31.29,67.26 37.19,61.37 39.01,61.37 40.64,59.74 | 30.89,67.26 30.48,67.26 U8.8 30.89,67.26 | 40.64,59.74 41.86,60.96 43.69,60.96 49.99,67.26 53.24,67.26 U7.8 | 40.64,59.74 U8.13 | U1.13 20.32,54.25 19.1,55.47 19.1,56.29 20.12,57.3 20.93,57.3 30.89,67.26
LATCH1
  Top 0.203: U1.12 28.45,50.8 37.19,59.54 38,59.54 U8.12 | U5.12 66.04,40.64 66.04,44.09 60.96,49.17 U7.12
  Bottom 0.203: U3.12 41.05,19.91 60.55,19.91 U4.12 62.38,21.54 63.6,20.32 65.23,20.32 66.04,21.13 66.04,21.95 74.57,30.48 U5.12 77.42,31.7 77.42,51.21 76.2,52.43 U6.12 | U9.14 34.34,42.06 34.34,55.88 38,59.54 U8.12 38.2,59.54 40.03,57.71 58.12,57.71 59.94,59.54 60.96,59.54 U7.12 | U2.12 20.32,28.85 18.69,30.48 18.69,49.17 U1.12 18.29,52.83 18.29,57.1 10.16,65.23 J9.3
MOSI
  Bottom 0.203: U1.14 21.54,54.66 21.54,53.03 39.22,35.36 39.22,34.34 U9.17 24.18,19.1 19.71,19.1 8.33,7.72 7.72,7.72 J12.4
N$1
  Top 0.203: R1.1 26.62,54.86 23.77,54.86 20.32,58.32 U1.15
N$2
  Top 0.203: U1.1 R2.1
N$3
  Top 0.203: R3.1 9.14,58.52 12.6,58.52 U1.2
N$4
  Top 0.203: U1.3 R4.1
N$5
  Top 0.203: R5.1 9.14,53.44 12.6,53.44 U1.4
N$6
  Top 0.203: U1.5 R6.1
N$7
  Top 0.203: R7.1 9.14,48.36 12.6,48.36 U1.6
N$8
  Top 0.203: U1.7 R8.1
N$9
  Top 0.203: U2.15 R9.1
N$10
  Top 0.203: R10.1 9.14,38.2 12.6,38.2 U2.1
N$11
  Top 0.203: U2.2 R11.1
N$12
  Top 0.203: R12.1 9.14,33.12 12.6,33.12 U2.3
N$13
  Top 0.203: U2.4 R13.1
N$14
  Top 0.203: R14.1 9.14,28.04 12.6,28.04 U2.5
N$15
  Top 0.203: U2.6 R15.1
N$16
  Top 0.203: R16.1 9.14,22.96 12.6,22.96 U2.7
N$17
  Top 0.203: R17.1 26.82,26.42 31.7,21.54 U3.15
N$18
  Top 0.203: R18.1 29.26,10.36 29.26,13.82 U3.1
N$19
  Top 0.203: R19.1 31.7,10.36 31.7,13.82 U3.2
N$20
  Top 0.203: R20.1 34.34,10.36 34.34,13.82 U3.3
N$21
  Top 0.203: R21.1 36.78,10.36 36.78,13.82 U3.4
N$22
  Top 0.203: R22.1 39.42,10.36 39.42,13.82 U3.5
N$23
  Top 0.203: R23.1 41.86,10.36 41.86,13.82 U3.6
N$24
  Top 0.203: R24.1 44.5,10.36 44.5,13.82 U3.7
N$25
  Top 0.203: R25.1 54.66,25.2 54.66,21.74 U4.15
N$26
  Top 0.203: R26.1 52.02,10.36 52.02,13.82 U4.1
N$27
  Top 0.203: R27.1 54.66,10.36 54.66,13.82 U4.2
N$28
  Top 0.203: R28.1 57.1,10.36 57.1,13.82 U4.3
N$29
  Top 0.203: R29.1 59.74,10.36 59.74,13.82 U4.4
N$30
  Top 0.203: R30.1 62.18,10.36 62.18,13.82 U4.5
N$31
  Top 0.203: R31.1 64.82,10.36 64.82,13.82 U4.6
N$32
  Top 0.203: R32.1 67.26,10.36 67.26,13.82 U4.7
N$33
  Top 0.203: R33.1 73.76,25.4 76.2,22.96 U5.15
N$34
  Top 0.203: U5.1 R34.1
N$35
  Top 0.203: R35.1 87.38,22.96 83.92,22.96 U5.2
N$36
  Top 0.203: U5.3 R36.1
N$37
  Top 0.203: R37.1 87.38,28.04 83.92,28.04 U5.4
N$38
  Top 0.203: U5.5 R38.1
N$39
  Top 0.203: R39.1 87.38,33.12 83.92,33.12 U5.6
N$40
  Top 0.203: U5.7 R40.1
N$41
  Top 0.203: R41.1 67.67,45.72 68.89,44.5 74.98,44.5 U6.15
N$42
  Top 0.203: R42.1 87.38,43.28 83.92,43.28 U6.1
N$43
  Top 0.203: U6.2 R43.1
N$44
  Top 0.203: R44.1 87.38,48.36 83.92,48.36 U6.3
N$45
  Top 0.203: U6.4 R45.1
N$46
  Top 0.203: R46.1 87.38,53.44 83.92,53.44 U6.5
N$47
  Top 0.203: U6.6 R47.1
N$48
  Top 0.203: R48.1 87.38,58.52 83.92,58.52 U6.7
N$49
  Top 0.203: R49.1 68.68,54.86 68.68,59.54 U7.15
N$50
  Top 0.203: U7.1 R50.1
N$51
  Top 0.203: R51.1 68.68,70.92 68.68,67.46 U7.2
N$52
  Top 0.203: U7.3 R52.1
N$53
  Top 0.203: R53.1 63.6,70.92 63.6,67.46 U7.4
N$54
  Top 0.203: U7.5 R54.1
N$55
  Top 0.203: R55.1 58.52,70.92 58.52,67.46 U7.6
N$56
  Top 0.203: U7.7 R56.1
N$57
  Top 0.203: U8.15 R57.1
N$58
  Top 0.203: R58.1 48.36,70.92 48.36,67.46 U8.1
N$59
  Top 0.203: U8.2 R59.1
N$60
  Top 0.203: R60.1 43.28,70.92 43.28,67.46 U8.3
N$61
  Top 0.203: U8.4 R61.1
N$62
  Top 0.203: R62.1 38.2,70.92 38.2,67.46 U8.5
N$63
  Top 0.203: U8.6 R63.1
N$64
  Top 0.203: R64.1 33.12,70.92 33.12,67.46 U8.7
N$65
  Top 0.203: R41.2 74.57,45.72 75.79,46.94 78.44,46.94 84.73,40.64 J6.1
N$66
  Top 0.203: R42.2 90.42,43.28 95.1,43.28 J6.2
N$67
  Top 0.203: J6.3 R43.2
N$68
  Top 0.203: R44.2 90.42,48.36 95.1,48.36 J6.4
N$69
  Top 0.203: J6.5 R45.2
N$70
  Top 0.203: R46.2 90.42,53.44 95.1,53.44 J6.6
N$71
  Top 0.203: J6.7 R47.2
N$72
  Top 0.203: R48.2 90.42,58.52 95.1,58.52 J6.8
N$73
  Top 0.203: R49.2 68.68,52.02 73.56,56.9 73.56,77.42 J7.1
N$74
  Top 0.203: J7.2 R50.2
N$75
  Top 0.203: R51.2 68.68,73.97 68.68,77.42 J7.3
N$76
  Top 0.203: J7.4 R52.2
N$77
  Top 0.203: R53.2 63.6,73.97 63.6,77.42 J7.5
N$78
  Top 0.203: J7.6 R54.2
N$79
  Top 0.203: R55.2 58.52,73.97 58.52,77.42 J7.7
N$80
  Top 0.203: J7.8 R56.2
N$81
  Top 0.203: R57.2 45.72,53.85 50.8,58.93 J8.1
N$82
  Top 0.203: R58.2 48.36,73.97 48.36,77.42 J8.2
N$83
  Top 0.203: J8.3 R59.2
N$84
  Top 0.203: R60.2 43.28,73.97 43.28,77.42 J8.4
N$85
  Top 0.203: J8.5 R61.2
N$86
  Top 0.203: R62.2 38.2,73.97 38.2,77.42 J8.6
N$87
  Top 0.203: J8.7 R63.2
N$88
  Top 0.203: R64.2 33.12,73.97 33.12,77.42 J8.8
N$89
  Top 0.203: C3.2 54.46,47.14 48.36,47.14 Y1.2 48.16,46.94 47.14,45.92 47.14,42.06 U9.9
N$90  (via drill 0.51)
  Top 0.203: v53.44,56.9 53.44,57.91 52.22,59.13 52.22,75.59 55.47,78.84 74.17,78.84 74.98,78.03 74.98,77.42 81.48,70.92 84.94,70.92 85.14,71.12 85.14,72.34 82.91,74.57 82.91,76 83.31,76.4 84.94,76.4 90.42,70.92 | 90.42,70.92 90.22,70.71 90.22,67.46 90.19,67.46 R68.2 | 90.42,70.92 92.86,73.36 92.86,75.46 S1.3
  Bottom 0.203: v53.44,56.9 53.44,41.45 54.46,40.44 54.46,34.34 U9.23
N$91
  Top 0.203: C2.2 36.98,47.14 43.08,47.14 Y1.1 43.28,46.94 44.3,45.92 44.3,42.06 U9.10
N$92
  Top 0.203: R65.2 72.54,39.62 72.54,41.25 75.59,44.3 80.47,44.3 85.55,39.22 95.71,39.22 96.52,40.03 96.52,58.93 93.07,62.38 93.07,71.73 S1.1 93.07,71.93 94.08,72.95 94.08,76.2 93.47,76.81 83.11,76.81 82.5,76.2 82.5,74.37 83.92,72.95 83.92,71.93 S2.1
N$93
  Top 0.203: U9.20 47.14,34.34 49.38,34.34 U9.21 52.02,36.78 52.02,41.86 U9.7
N$94
  Bottom 0.203: U9.8 52.02,39.42 52.02,34.34 U9.22 52.02,34.14 47.14,29.26 36.98,29.26 D1.K
N$95  (via drill 0.51)
  Top 0.203: v83.72,65.84 85.14,67.26 R67.2 85.34,67.46 85.55,67.67 85.55,72.54 84.12,73.97 84.12,75.39 S2.3
  Bottom 0.203: v83.72,65.84 78.84,65.84 74.17,61.16 74.17,60.96 71.73,58.52 71.53,58.52 60.96,47.95 60.96,41.45 57.3,37.8 57.3,34.34 U9.24
N$96
  Top 0.203: R66.1 44.3,26.62 36.98,26.62 D1.A
P1
  Top 0.203: R1.2 26.62,52.02 25.81,52.02 20.52,57.3 18.09,57.3 11.99,63.4 2.64,63.4 J1.1
P2
  Top 0.203: J1.2 R2.2
P3
  Top 0.203: R3.2 6.1,58.52 2.64,58.52 J1.3
P4
  Top 0.203: J1.4 R4.2
P5
  Top 0.203: R5.2 6.1,53.44 2.64,53.44 J1.5
P6
  Top 0.203: J1.6 R6.2
P7
  Top 0.203: R7.2 6.1,48.36 2.64,48.36 J1.7
P8
  Top 0.203: J1.8 R8.2
P9
  Top 0.203: R9.2 26.21,35.56 21.13,40.64 J2.1
P10
  Top 0.203: R10.2 6.1,38.2 2.64,38.2 J2.2
P11
  Top 0.203: J2.3 R11.2
P12
  Top 0.203: R12.2 6.1,33.12 2.64,33.12 J2.4
P13
  Top 0.203: J2.5 R13.2
P14
  Top 0.203: R14.2 6.1,28.04 2.64,28.04 J2.6
P15
  Top 0.203: J2.7 R15.2
P16
  Top 0.203: R16.2 6.1,22.96 2.64,22.96 J2.8
P17
  Top 0.203: J3.1 25.4,5.08 25.4,27.43 26.62,28.65 26.62,29.26 R17.2
P18
  Top 0.203: R18.2 29.26,7.32 29.26,3.86 J3.2
P19
  Top 0.203: R19.2 31.7,7.32 31.7,3.86 J3.3
P20
  Top 0.203: R20.2 34.34,7.32 34.34,3.86 J3.4
P21
  Top 0.203: R21.2 36.78,7.32 36.78,3.86 J3.5
P22
  Top 0.203: R22.2 39.42,7.32 39.42,3.86 J3.6
P23
  Top 0.203: R23.2 41.86,7.32 41.86,3.86 J3.7
P24
  Top 0.203: R24.2 44.5,7.32 44.5,3.86 J3.8
P25
  Top 0.203: R25.2 54.46,28.04 54.46,27.43 49.58,22.55 49.58,3.86 J4.1
P26
  Top 0.203: R26.2 52.02,7.32 52.02,3.86 J4.2
P27
  Top 0.203: R27.2 54.66,7.32 54.66,3.86 J4.3
P28
  Top 0.203: R28.2 57.1,7.32 57.1,3.86 J4.4
P29
  Top 0.203: R29.2 59.74,7.32 59.74,3.86 J4.5
P30
  Top 0.203: R30.2 62.18,7.32 62.18,3.86 J4.6
P31
  Top 0.203: R31.2 64.82,7.32 64.82,3.86 J4.7
P32
  Top 0.203: R32.2 67.26,7.32 67.26,3.86 J4.8
P33
  Top 0.203: R33.2 69.9,25.4 69.9,24.99 77.01,17.88 95.1,17.88 J5.1
P34
  Top 0.203: J5.2 R34.2
P35
  Top 0.203: R35.2 90.42,22.96 95.1,22.96 J5.3
P36
  Top 0.203: J5.4 R36.2
P37
  Top 0.203: R37.2 90.42,28.04 95.1,28.04 J5.5
P38
  Top 0.203: J5.6 R38.2
P39
  Top 0.203: R39.2 90.42,33.12 95.1,33.12 J5.7
P840
  Top 0.203: J5.8 R40.2
RST
  Top 0.203: R65.1 72.34,36.78 67.26,41.86 U9.1
  Bottom 0.203: J12.5 10.97,5.08 31.29,25.4 49.99,25.4 58.52,33.93 58.52,34.75 64.41,40.64 66.04,40.64 U9.1
RX
  Bottom 0.203: U9.2 64.82,42.06 64.82,48.77 75.79,59.74 80.87,59.74 83.31,62.18 95.71,62.18 96.52,62.99 96.52,64.01 95.3,65.23 95.3,66.04 J11.2
SCK
  Top 0.203: 44.5,30.48 44.5,34.14 U9.19 | 44.5,30.48 44.5,29.46 R66.2 | J12.3 8.33,5.08 9.75,3.66 10.57,3.66 24.99,18.09 24.99,29.87 25.6,30.48 44.5,30.48
TX
  Bottom 0.203: U9.3 62.38,42.06 62.38,48.56 74.57,60.76 74.57,60.96 77.01,63.4 95.1,63.4 J11.1
VCC
  Top 0.203: U6.16 76.2,43.08 74.98,41.86 74.98,37.59 76.2,36.37 U5.10 77.83,33.93 77.83,21.95 U5.16 | U3.16 29.26,21.54 30.07,21.54 31.29,20.32 43.08,20.32 44.3,21.54 U3.10 | U4.10 66.04,20.32 54.25,20.32 53.03,21.54 52.22,21.54 U4.16 | U2.10 20.32,23.77 19.1,24.99 19.1,36.78 20.32,38 U2.16 | J9.1 5.08,71.12 | 5.08,71.12 5.08,69.9 C1.1 | 5.08,71.12 10.16,71.12 U1.16 22.15,60.96 24.59,63.4 29.26,63.4 32.92,59.74 U8.10 33.12,59.74 34.75,61.37 45.72,61.37 47.35,59.74 48.16,59.74 U8.16 | U6.10 76.2,57.51 69.9,51.21 69.9,51 69.7,50.8 67.46,50.8 67.26,51 67.26,52.83 67.87,53.44 69.49,53.44 71.12,55.07 U7.16
  Bottom 0.203: U6.10 76.2,57.51 77.42,56.29 77.42,55.47 76.4,54.46 75.59,54.46 74.98,53.85 74.98,44.5 76.2,43.28 U6.16 | U4.16 52.02,21.74 48.56,21.74 47.55,22.76 45.52,22.76 44.5,21.74 U3.10 | U4.10 67.46,21.54 68.28,21.54 69.49,20.32 U5.16 86.63,9.89 J10.2 | U2.16 20.32,38.2 21.54,39.42 21.54,43.69 20.32,44.91 U1.10 20.32,46.53 21.54,47.75 21.54,51.21 20.52,52.22 19.71,52.22 18.69,53.24 18.69,59.33 U1.16 | J12.2 5.08,7.72 20.32,22.96 U2.10 | U8.16 48.36,59.54 51.82,59.54 52.83,58.52 54.86,58.52 55.88,59.54 U7.10 55.88,59.74 57.1,60.96 61.37,60.96 62.18,60.15 62.18,59.33 62.99,58.52 69.09,58.52 70.1,59.54 71.12,59.54 U7.16

### Text on the board
tPlace: AHERRERO